# Altium schematic sheet 4.7k ohm 75V SCH.schdoc
size 127 x 99 mm
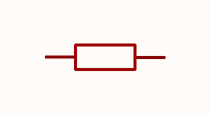
[diagram p0: 4.7k ohm 75V SCH.schdoc]

## Parts
R?  4.7kΩ  [R0603]  (value not drawn)

## Nets

Not connected (* = marked no-connect by the designer): R? 1 2

## Library data of the parts
R? = RC0603FR-074K7L: Manufacturer: YAGEO(国巨); Add into BOM: yes; Tolerance: ±1%; Temperature Coefficient: ±100ppm/℃; Symbol: RC0603FR-074K7L; Device: RC0603FR-074K7L; LCSC Part Name: 厚膜电阻 4.7kΩ ±1% 100mW; Supplier Part: C99782; Manufacturer Part: RC0603FR-074K7L; Supplier Footprint: 0603; JLCPCB Part Class: Extended Part; Datasheet: https://atta.szlcsc.com/upload/public/pdf/source/20180224/C181757_15194369480721363983.pdf; Supplier: LCSC; Convert to PCB: yes; Type: Thick Film Resistors; Value: 4.7kΩ; Operating Temperature Range: -55℃~+155℃